# EAGLE schematic Spark (EAGLE 7.2.0)
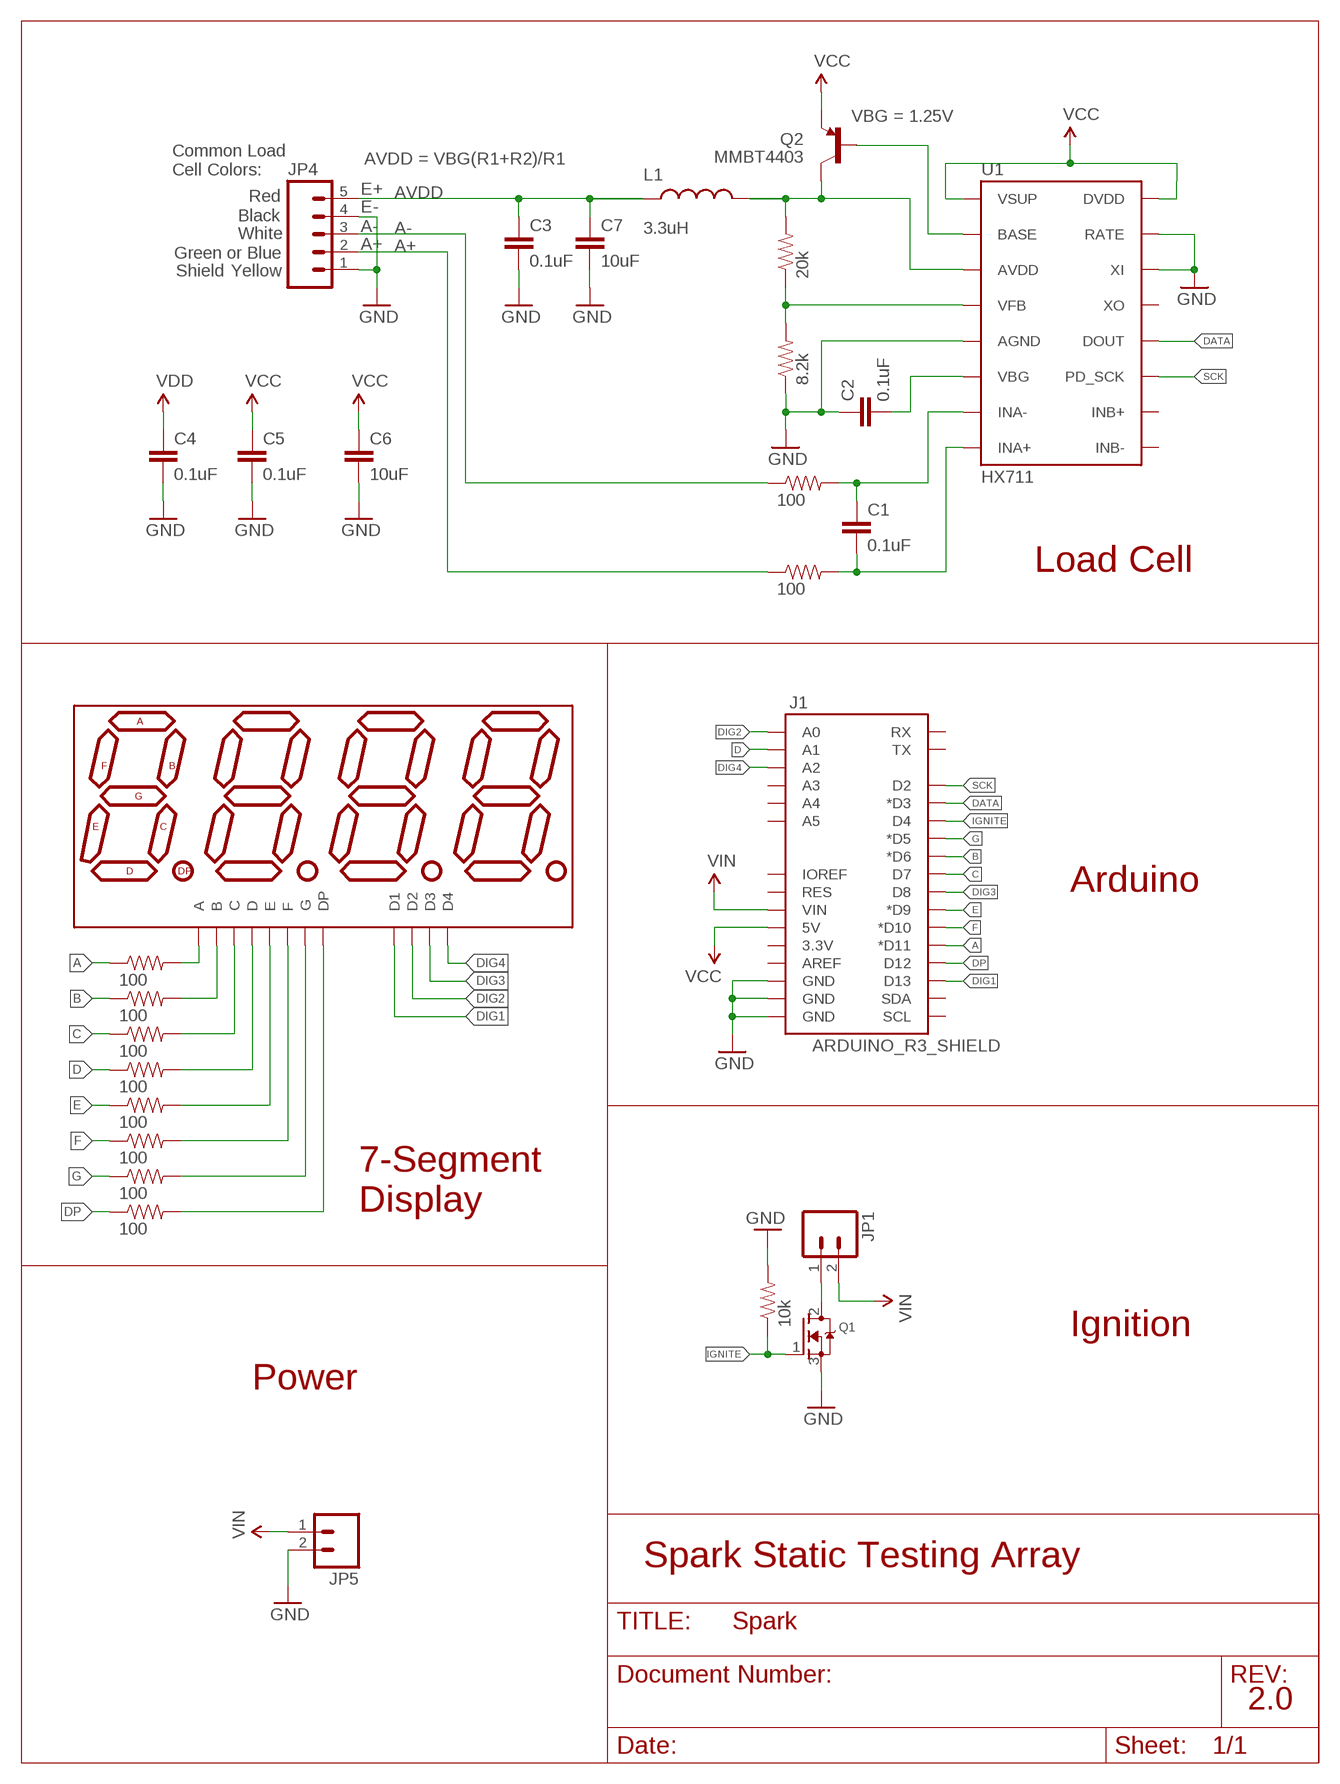
[diagram p0: schematic, sheet 1]

## Parts
C1  0.1uF  0.1UF-25V-5%(0603)  [0603-CAP]
C2  0.1uF  0.1UF-25V-5%(0603)  [0603-CAP]
C3  0.1uF  0.1UF-25V-5%(0603)  [0603-CAP]
C4  0.1uF  0.1UF-25V-5%(0603)  [0603-CAP]
C5  0.1uF  0.1UF-25V-5%(0603)  [0603-CAP]
C6  10uF  10UF50V20%(1210)  [1210]
C7  10uF  10UF50V20%(1210)  [1210]
J1  ARDUINO_R3_SHIELD  [UNO_R3_SHIELD]
JP1  M025MM  [SCREWTERMINAL-5MM-2]
JP4  M05PTH  [1X05]
JP5  M025MM  [SCREWTERMINAL-5MM-2]
L1  3.3uH  INDUCTOR0805  [0805]
Q1  MOSFET-NGDS_TO220V  [TO220V]
Q2  MMBT4403  TRANSISTOR_PNPMMBT4403  [SOT23-3]
R1  10k  RESISTOR0805-RES  [0805]
R3  100  RESISTOR0805-RES  [0805]
R4  100  RESISTOR0805-RES  [0805]
R6  100  RESISTOR0805-RES  [0805]
R7  100  RESISTOR0805-RES  [0805]
R8  100  RESISTOR0805-RES  [0805]
R9  100  RESISTOR0805-RES  [0805]
R10  100  RESISTOR0805-RES  [0805]
R11  100  RESISTOR0805-RES  [0805]
R12  100  RESISTOR0805-RES  [0805]
R13  100  RESISTOR0805-RES  [0805]
R14  8.2k  RESISTOR0805-RES  [0805]
R15  20k  RESISTOR0805-RES  [0805]
U1  HX711  HX711HX711  [SO16]
U$1  7-SEGMENT-4DIGIT-COUNTERPTH  [7-SEGMENT-4DIGIT-COUNTER]

## Nets
A: J1.D11(*D11) R13.1
A+: JP4.2 R4.1
A-: JP4.3 R3.1
AVDD: C3.1 C7.1 JP4.5 L1.1
B: J1.D6(*D6) R6.1
C: J1.D7 R7.1
D: J1.A1 R8.1
DATA: J1.D3(*D3) U1.12(DOUT)
DIG1: J1.D13 U$1.12(D1)
DIG2: J1.A0 U$1.9(D2)
DIG3: J1.D8 U$1.8(D3)
DIG4: J1.A2 U$1.6(D4)
DP: J1.D12 R12.1
E: J1.D9(*D9) R9.1
F: J1.D10(*D10) R10.1
G: J1.D5(*D5) R11.1
GND: C2.1 C3.2 C4.2 C5.2 C6.2 C7.2 J1.GND@0(GND) J1.GND@1(GND) J1.GND@2(GND) JP4.1 JP4.4 JP5.2 Q1.3(S) R1.2 R14.1 U1.5(AGND) U1.14(XI) U1.15(RATE)
IGNITE: J1.D4 Q1.1(G) R1.1
N$2: JP1.1 Q1.2(D)
N$3: C1.1 R3.2 U1.7(INA-)
N$4: Q2.1(B) U1.2(BASE)
N$5: L1.2 Q2.3(C) R15.2 U1.3(AVDD)
N$6: R14.2 R15.1 U1.4(VFB)
N$7: C2.2 U1.6(VBG)
N$8: C1.2 R4.2 U1.8(INA+)
N$10: U1.16(DVDD)
N$11: R13.2 U$1.11(A)
N$12: R6.2 U$1.7(B)
N$14: R7.2 U$1.4(C)
N$15: R8.2 U$1.2(D)
N$16: R9.2 U$1.1(E)
N$17: R10.2 U$1.10(F)
N$18: R11.2 U$1.5(G)
N$19: R12.2 U$1.3(DP)
SCK: J1.D2 U1.11(PD_SCK)
VCC: C5.1 C6.1 J1.5V Q2.2(E) U1.1(VSUP)
VDD: C4.1
VIN: J1.VIN JP1.2 JP5.1
Unconnected: J1.3.3V J1.A3 J1.A4 J1.A5 J1.AREF J1.IOREF J1.RES J1.RX J1.SCL J1.SDA J1.TX U1.9(INB-) U1.10(INB+) U1.13(XO)

## Notes on the sheet
- VBG = 1.25V
- AVDD = VBG(R1+R2)/R1
- Common Load
  Cell Colors:
- E+
- Red
- E-
- Black
- A-
- White
- A+
- Green or Blue
- Shield | Yellow
- Load Cell
- Arduino
- 7-Segment
  Display
- Ignition
- Power
- Spark Static Testing Array
- 2.0

## Library data of the parts
C1-C5 = SparkFun-Capacitors:0.1UF-25V-5%(0603): CAP-08604; PROD_ID: CAP-08604
C6 C7 = SparkFun-Capacitors:10UF50V20%(1210): CAP-09824; PROD_ID: CAP-09824
J1 = SparkFun-Boards:ARDUINO_R3_SHIELD: Shield form compatible with the Arduino Uno R3.
JP1 JP5 = SparkFun-Connectors:M02: Standard 2-pin 0.1" header. Use with - straight break away headers ( PRT-00116) - right angle break away headers (PRT-00553) - swiss pins (PRT-00743) - machine pins (PRT-00117) - female headers (PRT-00115) Molex polarized connector foot print use with: PRT-08233 with associated crimp pins and housings. 2.54_SCREWTERM for use with PRT-10571. 3.5mm Screw Terminal footprints for PRT-08084 5mm Screw Terminal footprints for use with PRT-08432; STOREFRONT_ID: PRT-08432
JP4 = SparkFun-Connectors:M05: Header 5 Standard 5-pin 0.1" header. Use with straight break away headers (SKU : PRT-00116), right angle break away headers (PRT-00553), swiss pins (PRT-00743), machine pins (PRT-00117), and female headers (PRT-00115). Molex polarized connector foot print use with SKU : PRT-08230 with associated crimp pins and housings.
L1 = SparkFun-Passives:INDUCTOR: Inductors Basic Inductor/Choke - 0603 and 1206. Footprints are not proven and vary greatly between part numbers. INDUCTOR POWER 3.3UH 4.0A SMD 0.197" L x 0.197" W x 0.177" H (5.00mm x 5.00mm x 4.50mm)
Q1 = adafruit:MOSFET-N: N-Channel Mosfet 2N7002E - 60V 260mA SOT23 [Digikey: 2N7002ET1GOSTR-ND] - REEL BSH103 - 30V 850mA SOT23 [Digikey: 568-5013-1-ND]
Q2 = SparkFun-DiscreteSemi:TRANSISTOR_PNP: Generic PNP BJT Double check pinouts against datasheets- not all devices are the same! MMBT3906 - 40V 200mA SOT-23 (TRANS-08052) MMBT4403 - 40V 600mA SOT-23 (TRANS-09245); PROD_ID: TRANS-09245
R1 R3 R4 R6-R15 = SparkFun-Resistors:RESISTOR: Resistor Basic schematic elements and footprints for 0603, 1206, and PTH resistors.
U1 = Testing:HX711; PROD_ID: IC-12445
U$1 = SparkFun-Displays:7-SEGMENT-4DIGIT-COUNTER